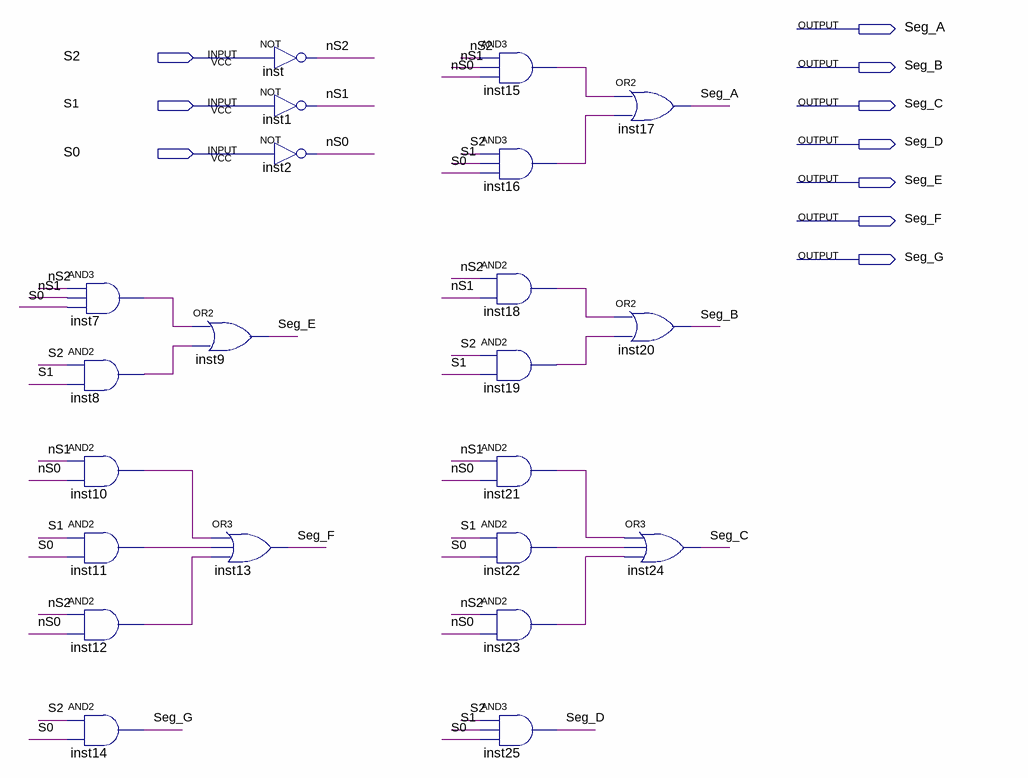
[diagram p0: schematic sheet]
// Quartus schematic HEX0.bdf as structural Verilog: 22 symbols, 10 pins
module HEX0 (
  input  S2,
  input  S1,
  input  S0,
  output Seg_A,
  output Seg_B,
  output Seg_C,
  output Seg_D,
  output Seg_E,
  output Seg_F,
  output Seg_G
);

  wire inst7_out, inst8_out, inst10_out, inst11_out, inst12_out, inst15_out, inst16_out, inst18_out,
       inst19_out, inst21_out, inst22_out, inst23_out, nS0, nS1, nS2;

  and inst7 (inst7_out, nS2, nS1, S0);
  and inst8 (inst8_out, S2, S1);
  and inst10 (inst10_out, nS1, nS0);
  and inst11 (inst11_out, S1, S0);
  and inst12 (inst12_out, nS2, nS0);
  and inst14 (Seg_G, S2, S0);
  or inst9 (Seg_E, inst7_out, inst8_out);
  or inst13 (Seg_F, inst10_out, inst11_out, inst12_out);
  not inst (nS2, S2);
  not inst1 (nS1, S1);
  not inst2 (nS0, S0);
  and inst15 (inst15_out, nS2, nS1, nS0);
  and inst16 (inst16_out, S2, S1, S0);
  and inst18 (inst18_out, nS2, nS1);
  and inst19 (inst19_out, S2, S1);
  and inst21 (inst21_out, nS1, nS0);
  and inst22 (inst22_out, S1, S0);
  and inst23 (inst23_out, nS2, nS0);
  and inst25 (Seg_D, S2, S1, S0);
  or inst17 (Seg_A, inst15_out, inst16_out);
  or inst20 (Seg_B, inst18_out, inst19_out);
  or inst24 (Seg_C, inst21_out, inst22_out, inst23_out);
endmodule
